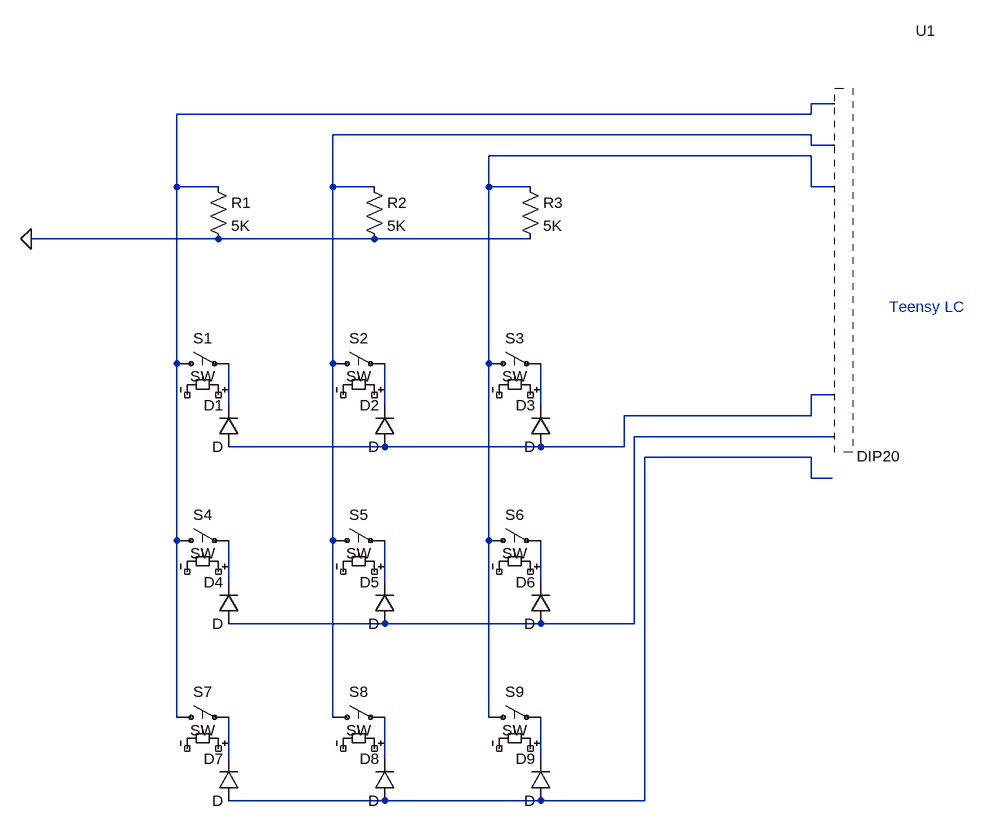
[diagram p0: schematic Key Matrix.asc]
Key Matrix.asc, the LTspice schematic file:
Version 4
SHEET 1 992 1060
WIRE -64 -208 -96 -208
WIRE -96 -192 -96 -208
WIRE -96 -192 -1072 -192
WIRE -96 -160 -832 -160
WIRE -96 -144 -96 -160
WIRE -64 -144 -96 -144
WIRE -96 -128 -592 -128
WIRE -1072 -80 -1072 -192
WIRE -1008 -80 -1072 -80
WIRE -832 -80 -832 -160
WIRE -768 -80 -832 -80
WIRE -592 -80 -592 -128
WIRE -528 -80 -592 -80
WIRE -96 -80 -96 -128
WIRE -64 -80 -96 -80
WIRE -1008 0 -1296 0
WIRE -768 0 -1008 0
WIRE -528 0 -768 0
WIRE -1072 192 -1072 -80
WIRE -832 192 -832 -80
WIRE -592 192 -592 -80
WIRE -64 240 -96 240
WIRE -992 256 -992 192
WIRE -752 256 -752 192
WIRE -512 256 -512 192
WIRE -96 272 -96 240
WIRE -96 272 -384 272
WIRE -64 304 -368 304
WIRE -752 320 -992 320
WIRE -512 320 -752 320
WIRE -384 320 -384 272
WIRE -384 320 -512 320
WIRE -96 336 -352 336
WIRE -96 368 -96 336
WIRE -64 368 -96 368
WIRE -1072 464 -1072 192
WIRE -832 464 -832 192
WIRE -592 464 -592 192
WIRE -992 528 -992 464
WIRE -752 528 -752 464
WIRE -512 528 -512 464
WIRE -752 592 -992 592
WIRE -512 592 -752 592
WIRE -368 592 -368 304
WIRE -368 592 -512 592
WIRE -1072 736 -1072 464
WIRE -832 736 -832 464
WIRE -592 736 -592 464
WIRE -992 800 -992 736
WIRE -752 800 -752 736
WIRE -512 800 -512 736
WIRE -752 864 -992 864
WIRE -512 864 -752 864
WIRE -352 864 -352 336
WIRE -352 864 -512 864
FLAG -1296 0 0
SYMBOL Misc\\DIP20 80 -176 R0
WINDOW 0 0 -144 Center 2
SYMATTR InstName U1
SYMBOL diode -976 320 R180
WINDOW 0 24 64 Left 2
WINDOW 3 24 0 Left 2
SYMATTR InstName D1
SYMBOL sw -1088 192 R270
WINDOW 0 24 56 VTop 2
WINDOW 3 -4 56 VBottom 2
SYMATTR InstName S1
SYMBOL diode -736 320 R180
WINDOW 0 24 64 Left 2
WINDOW 3 24 0 Left 2
SYMATTR InstName D2
SYMBOL sw -848 192 R270
WINDOW 0 24 56 VTop 2
WINDOW 3 -4 56 VBottom 2
SYMATTR InstName S2
SYMBOL diode -496 320 R180
WINDOW 0 24 64 Left 2
WINDOW 3 24 0 Left 2
SYMATTR InstName D3
SYMBOL sw -608 192 R270
WINDOW 0 24 56 VTop 2
WINDOW 3 -4 56 VBottom 2
SYMATTR InstName S3
SYMBOL diode -976 592 R180
WINDOW 0 24 64 Left 2
WINDOW 3 24 0 Left 2
SYMATTR InstName D4
SYMBOL sw -1088 464 R270
WINDOW 0 24 56 VTop 2
WINDOW 3 -4 56 VBottom 2
SYMATTR InstName S4
SYMBOL diode -736 592 R180
WINDOW 0 24 64 Left 2
WINDOW 3 24 0 Left 2
SYMATTR InstName D5
SYMBOL sw -848 464 R270
WINDOW 0 24 56 VTop 2
WINDOW 3 -4 56 VBottom 2
SYMATTR InstName S5
SYMBOL diode -496 592 R180
WINDOW 0 24 64 Left 2
WINDOW 3 24 0 Left 2
SYMATTR InstName D6
SYMBOL sw -608 464 R270
WINDOW 0 24 56 VTop 2
WINDOW 3 -4 56 VBottom 2
SYMATTR InstName S6
SYMBOL diode -976 864 R180
WINDOW 0 24 64 Left 2
WINDOW 3 24 0 Left 2
SYMATTR InstName D7
SYMBOL sw -1088 736 R270
WINDOW 0 24 56 VTop 2
WINDOW 3 -4 56 VBottom 2
SYMATTR InstName S7
SYMBOL diode -736 864 R180
WINDOW 0 24 64 Left 2
WINDOW 3 24 0 Left 2
SYMATTR InstName D8
SYMBOL sw -848 736 R270
WINDOW 0 24 56 VTop 2
WINDOW 3 -4 56 VBottom 2
SYMATTR InstName S8
SYMBOL diode -496 864 R180
WINDOW 0 24 64 Left 2
WINDOW 3 24 0 Left 2
SYMATTR InstName D9
SYMBOL sw -608 736 R270
WINDOW 0 24 56 VTop 2
WINDOW 3 -4 56 VBottom 2
SYMATTR InstName S9
SYMBOL res -1024 -96 R0
SYMATTR InstName R1
SYMATTR Value 5K
SYMBOL res -784 -96 R0
SYMATTR InstName R2
SYMATTR Value 5K
SYMBOL res -544 -96 R0
SYMATTR InstName R3
SYMATTR Value 5K
TEXT 24 104 Left 2 ;Teensy LC

The netlist it stands for:
* Key Matrix.asc
* U1: DIP20 (symbol Misc\DIP20 not available, pin order unknown); nets seen at it: N001, N002, N003, N004, N008
D1 N004 N005 D
S1 N001 N005 NC_01 NC_02 SW
D2 N004 N006 D
S2 N002 N006 NC_03 NC_04 SW
D3 N004 N007 D
S3 N003 N007 NC_05 NC_06 SW
D4 N008 N010 D
S4 N001 N010 NC_07 NC_08 SW
D5 N008 N011 D
S5 N002 N011 NC_09 NC_10 SW
D6 N008 N012 D
S6 N003 N012 NC_11 NC_12 SW
D7 N009 N013 D
S7 N001 N013 NC_13 NC_14 SW
D8 N009 N014 D
S8 N002 N014 NC_15 NC_16 SW
D9 N009 N015 D
S9 N003 N015 NC_17 NC_18 SW
R1 N001 0 5K
R2 N002 0 5K
R3 N003 0 5K
.model D D
.lib standard.dio
* Teensy LC
.backanno
.end